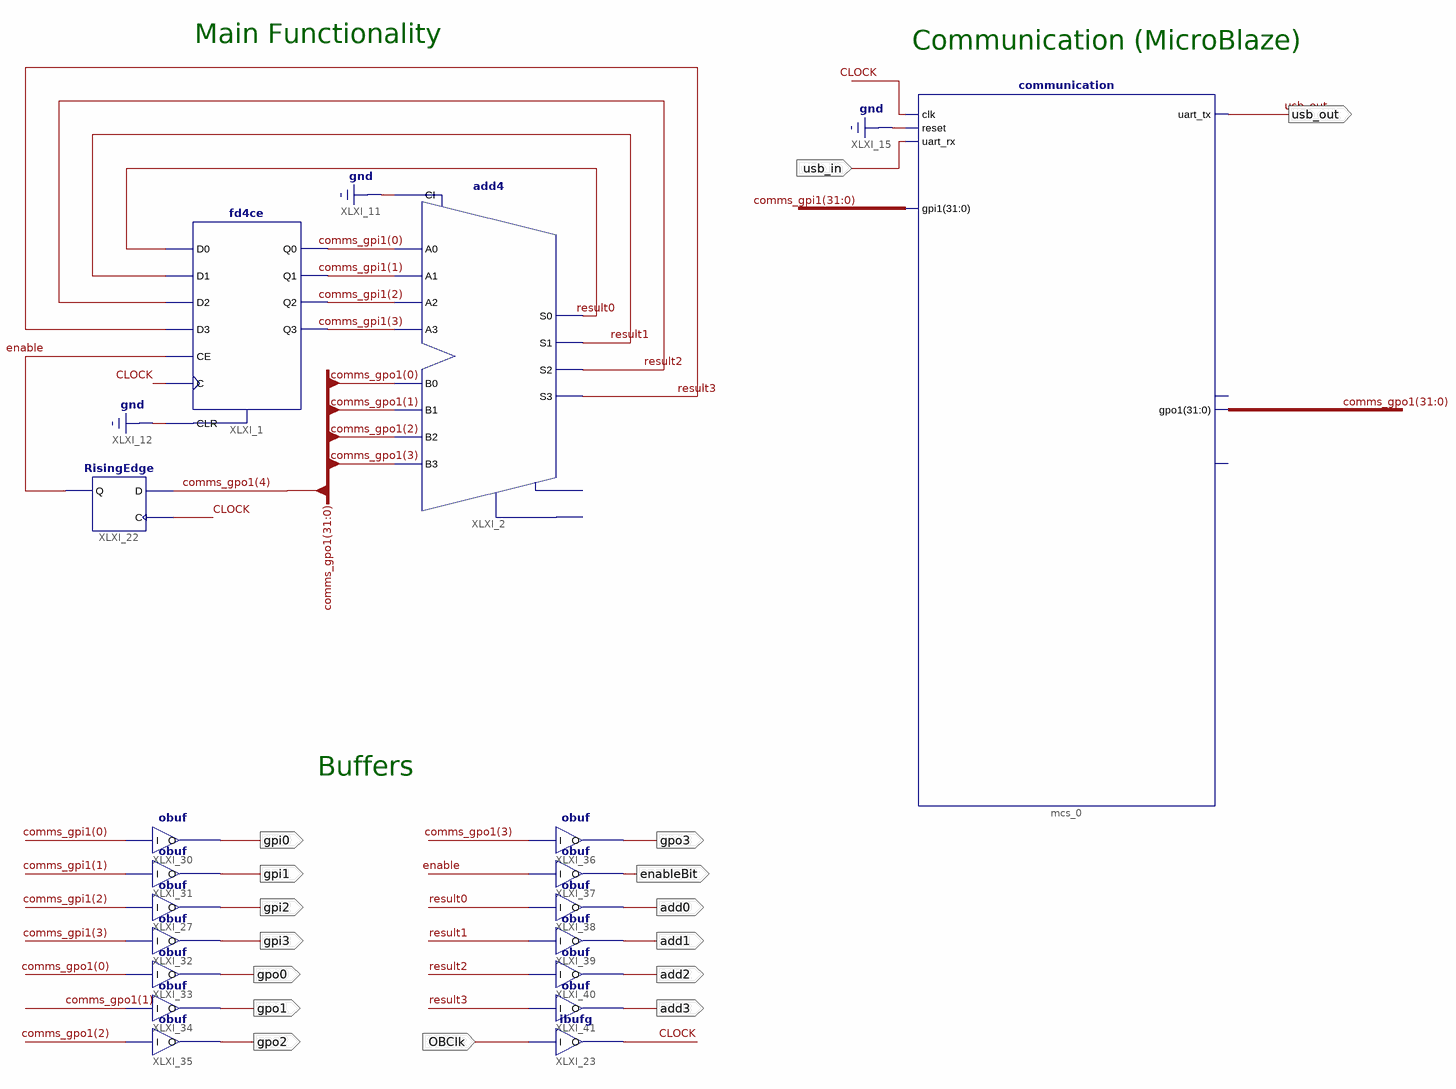
[diagram p0: schematic sheet 1]
// Xilinx ISE schematic simple.sch (artix7) as structural Verilog: 18 symbols, 16 ports
module simple (
  input  usb_in,
  input  OBClk,
  output usb_out,
  output gpo3,
  output enableBit,
  output add0,
  output add1,
  output add2,
  output add3,
  output gpi2,
  output gpi3,
  output gpo0,
  output gpo1,
  output gpo2,
  output gpi1,
  output gpi0
);

  wire CLOCK, enable, result0, result1, result2, result3;
  wire [31:0] comms_gpi1, comms_gpo1;

  fd4ce XLXI_1 (
    .C(CLOCK), .CE(enable), .CLR(1'b0), .D0(result0), .D1(result1), .D2(result2), .D3(result3),
    .Q0(comms_gpi1[0]), .Q1(comms_gpi1[1]), .Q2(comms_gpi1[2]), .Q3(comms_gpi1[3]));
  add4 XLXI_2 (
    .A0(comms_gpi1[0]), .A1(comms_gpi1[1]), .A2(comms_gpi1[2]), .A3(comms_gpi1[3]), .B0(comms_gpo1[0]),
    .B1(comms_gpo1[1]), .B2(comms_gpo1[2]), .B3(comms_gpo1[3]), .CI(1'b0), .S0(result0), .S1(result1),
    .S2(result2), .S3(result3));  // open: CO, OFL
  RisingEdge XLXI_22 (.D(comms_gpo1[4]), .C(CLOCK), .Q(enable));
  communication mcs_0 (
    .clk(CLOCK), .reset(1'b0), .uart_tx(usb_out), .uart_rx(usb_in), .gpi1(comms_gpi1), .gpo1(comms_gpo1));  // open: uart_interrupt, intc_irq
  obuf XLXI_27 (.I(comms_gpi1[2]), .O(gpi2));
  obuf XLXI_30 (.I(comms_gpi1[0]), .O(gpi0));
  obuf XLXI_31 (.I(comms_gpi1[1]), .O(gpi1));
  obuf XLXI_32 (.I(comms_gpi1[3]), .O(gpi3));
  obuf XLXI_33 (.I(comms_gpo1[0]), .O(gpo0));
  obuf XLXI_34 (.I(comms_gpo1[1]), .O(gpo1));
  obuf XLXI_35 (.I(comms_gpo1[2]), .O(gpo2));
  obuf XLXI_36 (.I(comms_gpo1[3]), .O(gpo3));
  obuf XLXI_37 (.I(enable), .O(enableBit));
  obuf XLXI_38 (.I(result0), .O(add0));
  obuf XLXI_39 (.I(result1), .O(add1));
  obuf XLXI_40 (.I(result2), .O(add2));
  obuf XLXI_41 (.I(result3), .O(add3));
  ibufg XLXI_23 (.I(OBClk), .O(CLOCK));

  // Notes on the sheet:
  //   Main Functionality
  //   Communication (MicroBlaze)
  //   Buffers
endmodule
